# EAGLE design gpio8p2 (EAGLE 7.2.0)
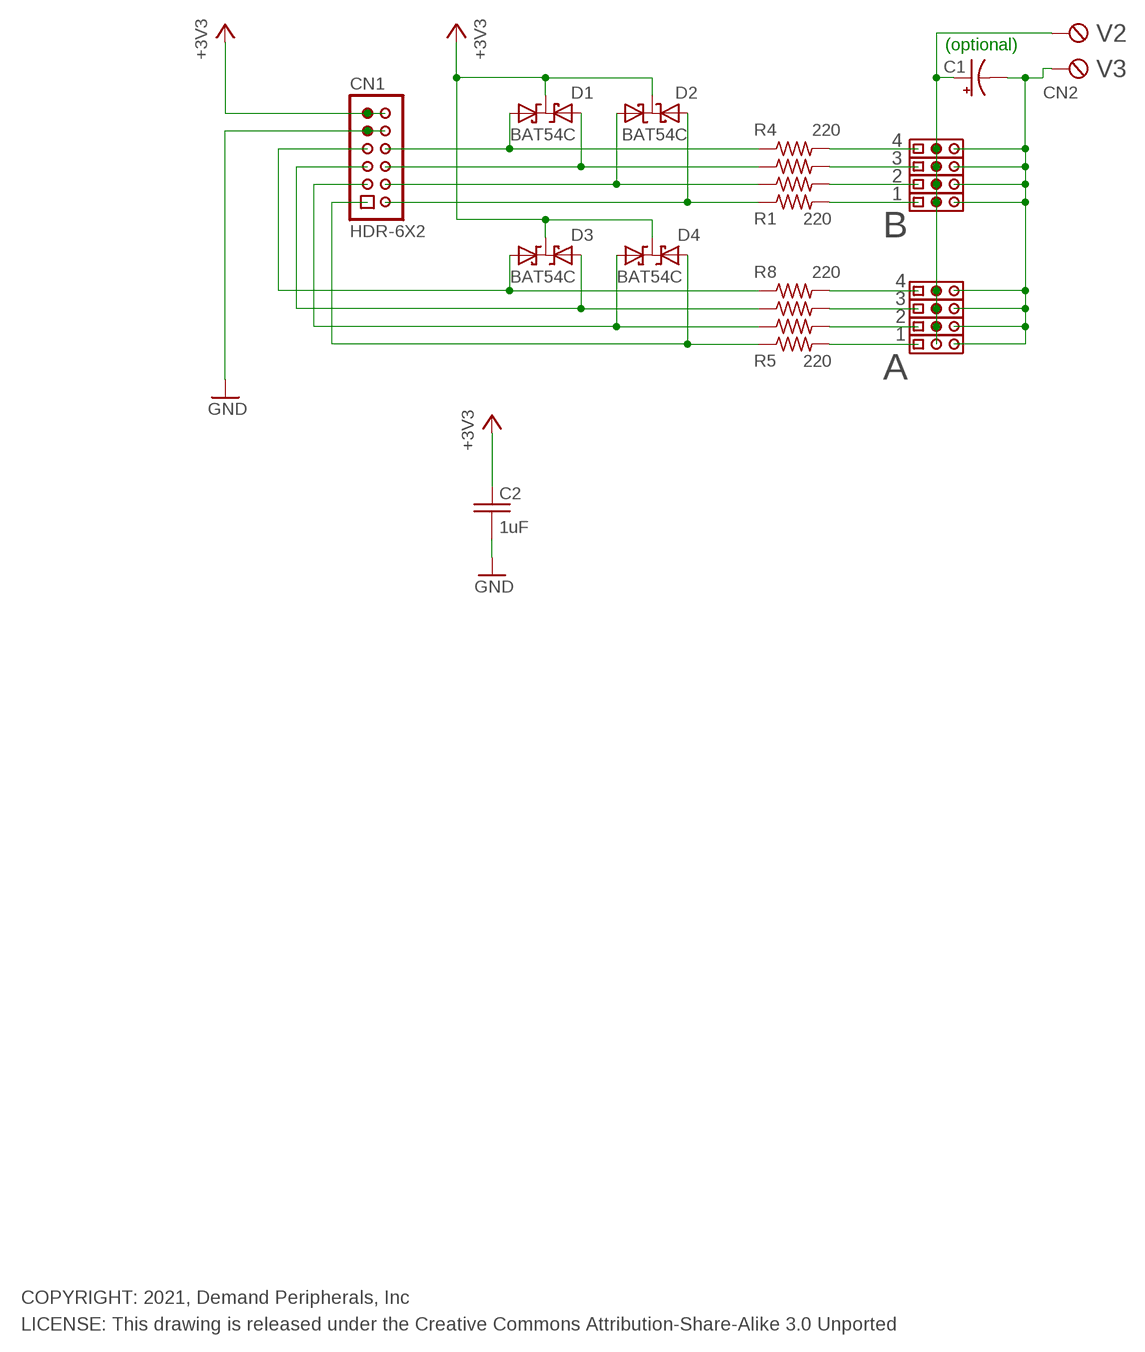
[diagram p0: schematic, sheet 1]

## Parts
C1  100uF  C100UF_E3.5-8  [E3.5-8]
C2  1uF  C1.0UF_C0603  [C0603]
CN1  HDR-6X2  [HDR-6X2]
CN2  TBLK-5.08-X2  [TBLK-5.08-X2]
D1  BAT54C  [SOT23]
D2  BAT54C  [SOT23]
D3  BAT54C  [SOT23]
D4  BAT54C  [SOT23]
R1  220  R220_R0603  [R0603]
R2  220  R220_R0603  [R0603]
R3  220  R220_R0603  [R0603]
R4  220  R220_R0603  [R0603]
R5  220  R220_R0603  [R0603]
R6  220  R220_R0603  [R0603]
R7  220  R220_R0603  [R0603]
R8  220  R220_R0603  [R0603]
U$5  HDR-3X1  [HDR-3X1]
U$6  HDR-3X1  [HDR-3X1]
U$7  HDR-3X1  [HDR-3X1]
U$9  HDR-3X1  [HDR-3X1]
U$10  HDR-3X1  [HDR-3X1]
U$11  HDR-3X1  [HDR-3X1]
U$12  HDR-3X1  [HDR-3X1]
U$13  HDR-3X1  [HDR-3X1]

## Nets
+3V3: C2.1 CN1.11 CN1.12 D1.3(CC) D2.3(CC) D3.3(CC) D4.3(CC)
GND: C2.2 CN1.9 CN1.10
N$1: R4.2 U$5.1
N$2: R3.2 U$6.1
N$3: R2.2 U$7.1
N$4: R1.2 U$9.1
N$7: C1.- CN2.1(KL) U$5.3 U$6.3 U$7.3 U$9.3 U$10.3 U$11.3 U$12.3 U$13.3
N$8: CN1.7 D3.2(A) R8.1
N$9: CN1.5 D3.1(A1) R7.1
N$10: CN1.3 D4.2(A) R6.1
N$11: CN1.8 D1.2(A) R4.1
N$12: CN1.6 D1.1(A1) R3.1
N$13: CN1.1 D4.1(A1) R5.1
N$14: CN1.4 D2.1(A1) R2.1
N$15: CN1.2 D2.2(A) R1.1
N$16: R8.2 U$10.1
N$17: R7.2 U$11.1
N$18: C1.+ CN2.2(KL1) U$5.2 U$6.2 U$7.2 U$9.2 U$10.2 U$11.2 U$12.2 U$13.2
N$19: R6.2 U$12.1
N$20: R5.2 U$13.1

## Notes on the sheet
- V2
- (optional)
- V3
- 4
- 3
- 2
- 1
- B
- 4
- 3
- 2
- 1
- A
- COPYRIGHT: 2021, Demand Peripherals, Inc
- LICENSE: This drawing is released under the Creative Commons Attribution-Share-Alike 3.0 Unported

## Library data of the parts
C1 = dpi-passive:C100UF_: 100uF polarized capacitor, general purpose; VENDOR: Digikey; VENDOR-PART-NUM: 1572-1044-ND
C2 = dpi-passive:C1.0UF_: 1.0 uF Capacitor, 25V, Y5V; VENDOR: Digikey; VENDOR-PART-NUM: 490-3897-2-ND
CN1 = dpi-conn:HDR-6X2: Right angle 6x2 header
CN2 = dpi-conn:TBLK-5.08-X2: Terminal Block, 5.08mm, x2, screw terminals; VENDOR: Digikey; VENDOR-PART-NUM: ED2609-ND
D1-D4 = dpi-diopto:BAT54C: BAT54C Dual Common Cathode Schottky; VENDOR: Digikey; VENDOR-PART-NUM: DB3X313N0LCT-ND
R1-R8 = dpi-passive:R220_: 220 Ohm resistor, 1%, 0.1 watt; VENDOR: Digikey; VENDOR-PART-NUM: 311-220HRTR-ND
U$5-U$7 U$9-U$13 = dpi-conn:HDR-3X1: 3 pin header on 0.1 inch centers, no shroud, no lock; VENDOR: Digikey; VENDOR-PART-NUM: 952-2264-ND

## Board
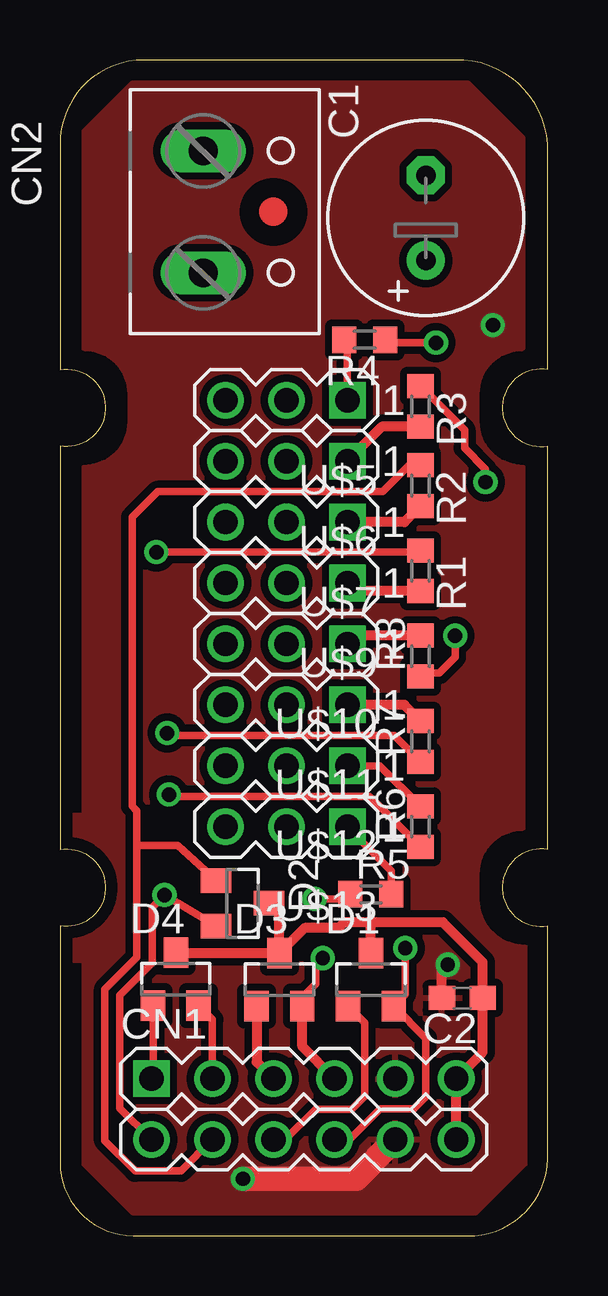
[diagram p1: board, top side]
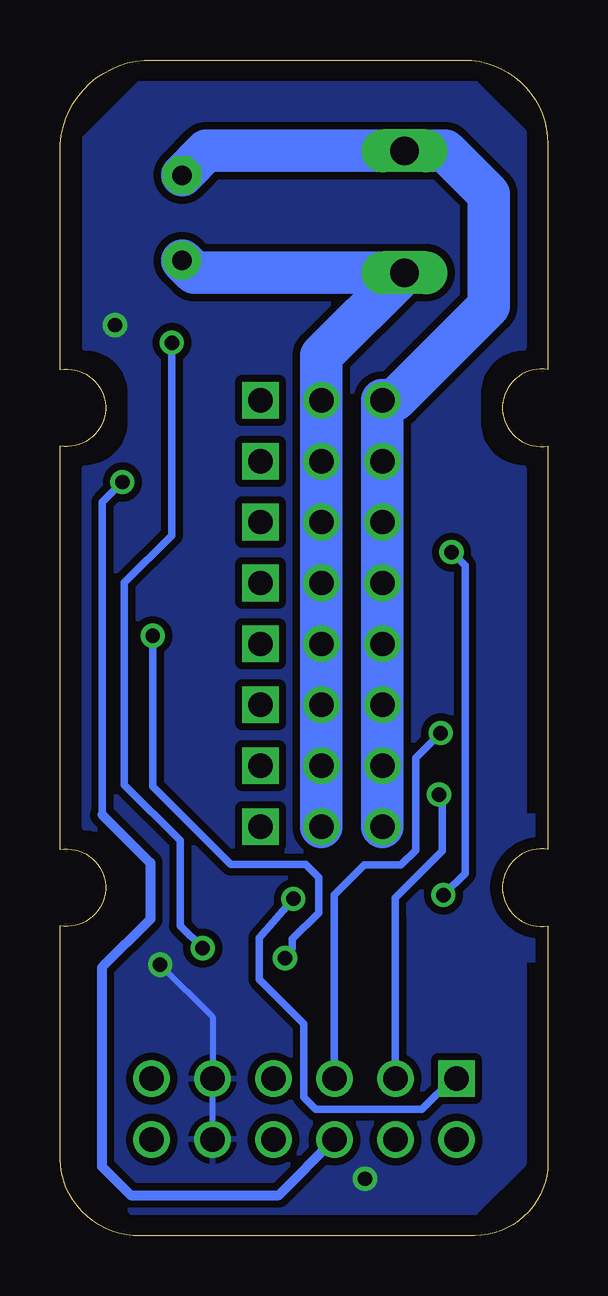
[diagram p2: board, bottom side, seen from below]

Size 20.33 x 49 mm. Coordinates in mm from the lower left corner, seen from the top.
Outline: 20.32,36.09 arc200 20.32,32.91 20.32,16.09 arc200 20.32,12.91 20.32,3.5 arc-90 17.27,0 3.05,0 arc-90 0,3.05 0,12.91 arc200 0,16.09 0,32.91 arc200 0,36.09 0,45.5 arc-90 3.5,49 16.82,49 arc-81 20.32,45.5 20.32,36.09
Copper layers (1*16): Top 0.035mm / dielectric 1.5mm / Bottom 0.035mm
Design rules "default *": minimum track width 10mil, minimum drill 20mil, track to track 12mil, track to pad 12mil, pad to pad 12mil, via to via 12mil, smd to smd 12mil, copper to edge 20mil, drill to drill 8mil, minimum pad ring 10mil, minimum via ring 8mil, stop-mask expansion 4mil, vias tented up to drill 0mil, thermal gap 10mil

### Footprints (pad centres in the part's own frame; a part is rotated, then mirrored left to right if it is on the bottom)
E3.5-8 = drill 0.813 pad 1.6: + -1.778,0 | drill 0.813 pad 1.6 octagon: - 1.778,0
C0603 = smd 1.1 x 1: 1 -0.85,0; 2 0.85,0
HDR-6X2 = drill 1.016 square: 1 1.27,6.35 | drill 1.016: 2 -1.27,6.35; 3 1.27,3.81; 4 -1.27,3.81; 5 1.27,1.27; 6 -1.27,1.27; 7 1.27,-1.27; 8 -1.27,-1.27; 9 1.27,-3.81; 10 -1.27,-3.81; 11 1.27,-6.35; 12 -1.27,-6.35
TBLK-5.08-X2 = drill 1.194 long: 1 -2.54,-0.127; 2 2.54,-0.127
SOT23 = smd 1.016 x 1.27: 1 -0.95,-1.1; 2 0.95,-1.1; 3 0,1.1
R0603 = smd 1 x 1.1: 1 -0.85,0; 2 0.85,0
HDR-3X1 = drill 1.016 square: 1 -2.54,0 | drill 1.016: 2 0,0; 3 2.54,0

### Placement (x,y rotation side)
C1  15.24,42.42 90 top
C2  16.76,9.91 180 top
CN1  10.16,5.27 90 top
CN2  6.1,42.67 270 top
D1  12.95,10.67 0 top
D2  7.6,13.85 270 top
D3  9.14,10.67 0 top
D4  4.83,10.68 0 top
R1  15.02,27.71 270 top
R2  15.02,31.26 270 top
R3  15.02,34.56 270 top
R4  12.7,37.34 180 top
R5  12.95,14.22 0 top
R6  15.02,17.04 90 top
R7  15.02,20.59 90 top
R8  15.02,24.15 90 top
U$2  DP_FRAME_P  [P_FRAME]  -2.54,-2.54 0 top
U$5  9.43,34.82 180 top
U$6  9.43,32.28 180 top
U$7  9.43,29.74 180 top
U$9  9.43,27.2 180 top
U$10  9.43,24.66 180 top
U$11  9.43,22.12 180 top
U$12  9.43,19.58 180 top
U$13  9.43,17.04 180 top
U$15  [FIDUCIAL]  8.89,42.67 0 top

### Tracks (layer width: path | path; a pad name or v marks a point on that pad's centre or on a via)
+3V3
  Top 0.406: CN1.12 CN1.11 17.61,7.64 C2.1 17.61,11.39 16.21,12.8 15.95,13.06 12.47,13.06 | 12.47,13.06 12.88,13.06 12.95,12.98 D1.3 | 12.47,13.06 11.85,13.06 11.61,12.82 10.19,12.82 D3.3 | D3.3 9.14,13.4 D2.3 | D3.3 4.84,11.77 D4.3
GND  (via drill 0.6)
  Top 0.406: C2.2 15.91,11.29 v16.15,11.29
  Top 1.016: CN1.10 12.33,2.37 v7.62,2.37
  Bottom 0.254: CN1.10 CN1.9 13.97,9.11 v16.15,11.29
  other vias: 18.03,37.95
  pour Bottom: 1.01,2.99 3.04,0.96 17.32,0.96 19.37,3.01 19.37,12 arc-90 17.37,14 17.37,15.08 arc-90 19.29,17 19.29,32 arc-90 17.37,33.92 17.37,35.09 arc-90 19.28,37 19.28,45.75 17.01,48.02 3.02,48.02 1.01,46.01 1.01,37 arc-90 2.92,35.09 2.92,33.91 arc-90 1.01,32 1.01,17.5 0.55,17.5 0.55,11.5 1,11.5
  pour Top: 1.01,2.99 3.04,0.96 17.32,0.96 19.37,3.01 19.37,12 arc-90 17.37,14 17.37,15.08 arc-90 19.29,17 19.29,32 arc-90 17.37,33.92 17.37,35.09 arc-90 19.28,37 19.28,45.75 17.01,48.02 3.02,48.02 1.01,46.01 1.01,37 arc-90 2.92,35.09 2.92,33.91 arc-90 1.01,32 1.01,17.5 0.55,17.5 0.55,11.5 1,11.5
N$1
  Top 0.305: R4.2 11.97,37.21 U$5.1
N$2
  Top 0.406: R3.2 13.41,33.71 U$6.1
N$3
  Top 0.406: R2.2 14.35,29.74 U$7.1
N$4
  Top 0.406: R1.2 12.32,26.86 U$9.1
N$7
  Bottom 1.778: C1.- 14.22,45.21 CN2.1 4.28,45.21 2.46,43.4 2.46,38.73 4.75,36.45 6.38,34.82 U$5.3 U$6.3 U$7.3 U$9.3 U$10.3 U$11.3 U$12.3 U$13.3
N$8  (via drill 0.6)
  Top 0.305: D3.2 10.09,9.94 10.65,10.49 10.65,11.39 v10.95,11.56 | R8.1 15.17,23.45 15.8,23.45 16.19,23.84 16.46,24.11 v16.46,25
  Top 0.406: CN1.7 10.09,7.88 D3.2
  Bottom 0.305: v10.95,11.56 10.64,11.98 10.64,12.36 9.55,13.45 9.55,13.58 9.55,14.92 10.09,15.46 13.2,15.46 16.46,18.72 16.46,19.39 v16.46,25
N$9  (via drill 0.6)
  Top 0.305: R7.1 13.92,20.85 11.32,20.85 4.56,20.85 v4.46,20.95
  Top 0.406: D3.1 8.19,7.24 CN1.5
  Bottom 0.305: CN1.5 8.89,12.67 8.89,14.19 7.64,15.44 6.12,15.44 5.51,16.05 5.51,19.44 5.51,19.9 v4.46,20.95
N$10  (via drill 0.6)
  Top 0.305: CN1.3 6.35,9.01 D4.2 | R6.1 15.01,16.19 12.98,18.21 12.88,18.31 11.52,18.31 4.6,18.31 v4.53,18.38
  Bottom 0.305: CN1.3 6.35,13.24 6.35,14.08 4.4,16.02 4.4,18.11 4.4,18.25 v4.53,18.38
N$11  (via drill 0.6)
  Top 0.305: CN1.8 12.07,4 13.35,5.28 14.73,5.28 15.24,5.79 15.24,7.28 15.24,8.23 D1.2 14.38,10.05 v14.38,11.98 | R4.1 13.67,37.22 v15.66,37.22
  Bottom 0.305: v15.66,37.22 15.66,29.19 17.64,27.21 17.64,18.78 15.32,16.46 15.32,12.92 v14.38,11.98
N$12  (via drill 0.6)
  Top 0.305: CN1.6 9.39,4 10.66,5.26 12.16,5.26 12.63,5.73 12.7,5.81 12.7,7.28 12.7,8.87 D1.1 | R3.1 16.86,33.58 16.86,32.82 17.73,31.95 v17.73,31.41
  Bottom 0.305: v17.73,31.41 18.56,30.57 18.56,17.54
  Bottom 0.406: 18.56,17.54 16.57,15.54 16.57,13.18 18.58,11.17 18.58,2.88 17.39,1.68 11.21,1.68 CN1.6
N$13  (via drill 0.6)
  Top 0.305: R5.1 11.69,14.03 v10.6,14.04 | D4.1 3.88,6.61 CN1.1
  Bottom 0.305: v10.6,14.04 12.02,12.41 12.02,10.68 10.17,8.83 10.17,5.76 9.67,5.26 5.25,5.26 3.96,6.54 CN1.1
N$14
  Top 0.305: CN1.4 5.04,2.69 3.13,2.69 1.88,3.96 1.88,8.32 1.88,10.26 3.06,11.45 3.21,11.6 3.21,13.86 3.21,16.25 | D2.1 4.91,16.25 3.21,16.25 | 3.21,16.25 3.21,17.7 3.1,17.8 3,17.9 3,29.95 4.06,31.01 11.19,31.01 13.44,31.01 13.57,31.14 14.55,32.11 R2.1
N$15  (via drill 0.6)
  Top 0.305: CN1.2 2.5,5.31 2.5,10.02 3.43,10.95 3.84,11.36 3.84,13.35 3.84,13.68 v4.35,14.19 D2.2 | v4.02,28.48 14.95,28.48 R1.1
  Bottom 0.305: v4.35,14.19 3.45,15.09 3.45,21.82 3.45,27.92 v4.02,28.48
N$16
  Top 0.406: R8.2 12.32,25 U$10.1
N$17
  Top 0.406: R7.2 14.35,22.12 U$11.1
N$18
  Bottom 1.778: C1.+ 14.73,40.13 CN2.2 9.43,36.67 U$5.2 U$6.2 U$7.2 U$9.2 U$10.2 U$11.2 U$12.2 U$13.2
N$19
  Top 0.305: R6.2 13.33,19.58 U$12.1
N$20
  Top 0.305: R5.2 13.8,15.21 U$13.1

### Text on the board
tTest: 0.8 in | 20 mm | V3 | C1 | Optional | V3 | V2 | V2 | R4 | 1 | R3 | 2 | R2 | 3 | B | 4 | 20 mm | 49 mm | R1 | 1 | A | 2 | R8 | 3 | R7 | 4 | R6 | GPIO8p2 Rev 21B | D2 | R5 | D4 | D3 | D1 | CN1 | C2
bTest: (C) 2021, Demand Peripherals, Inc.